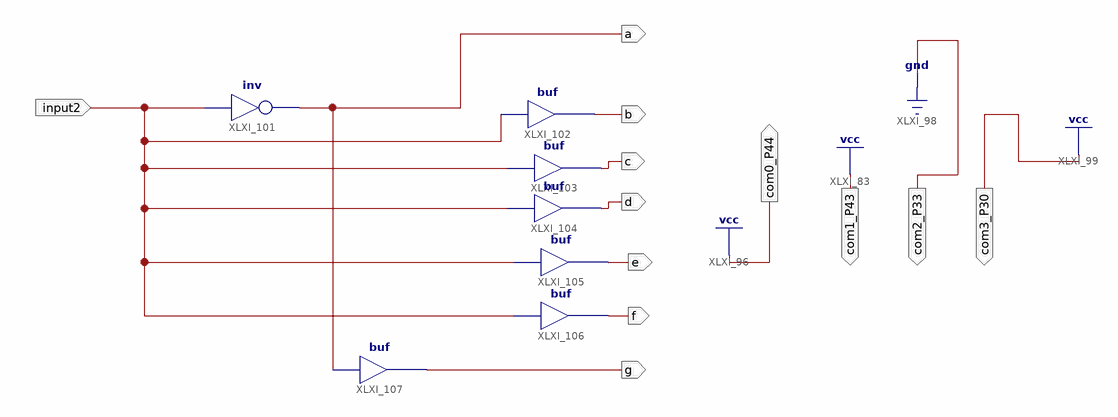
[diagram p0: schematic sheet 1]
// Xilinx ISE schematic U.sch (spartan6) as structural Verilog: 7 symbols, 12 ports
module U (
  input  input2,
  output com1_P43,
  output com2_P33,
  output com3_P30,
  output com0_P44,
  output a,
  output f,
  output e,
  output d,
  output c,
  output b,
  output g
);

  not XLXI_101 (a, input2);
  buf XLXI_102 (b, input2);
  buf XLXI_103 (c, input2);
  buf XLXI_104 (d, input2);
  buf XLXI_105 (e, input2);
  buf XLXI_106 (f, input2);
  buf XLXI_107 (g, a);

  assign com0_P44 = 1'b1;
  assign com1_P43 = 1'b1;
  assign com2_P33 = 1'b0;
  assign com3_P30 = 1'b1;
endmodule
